# EasyEDA schematic SCH_PCB - project_2022-06-17.json

## Sheets
1 Sheet_1: TITLE: Task 7.3D PWM; REV: 1.0; Date: 2022-06-16; Sheet: 1/1; Drawn By: Frozen; Company: Avinash Maurya
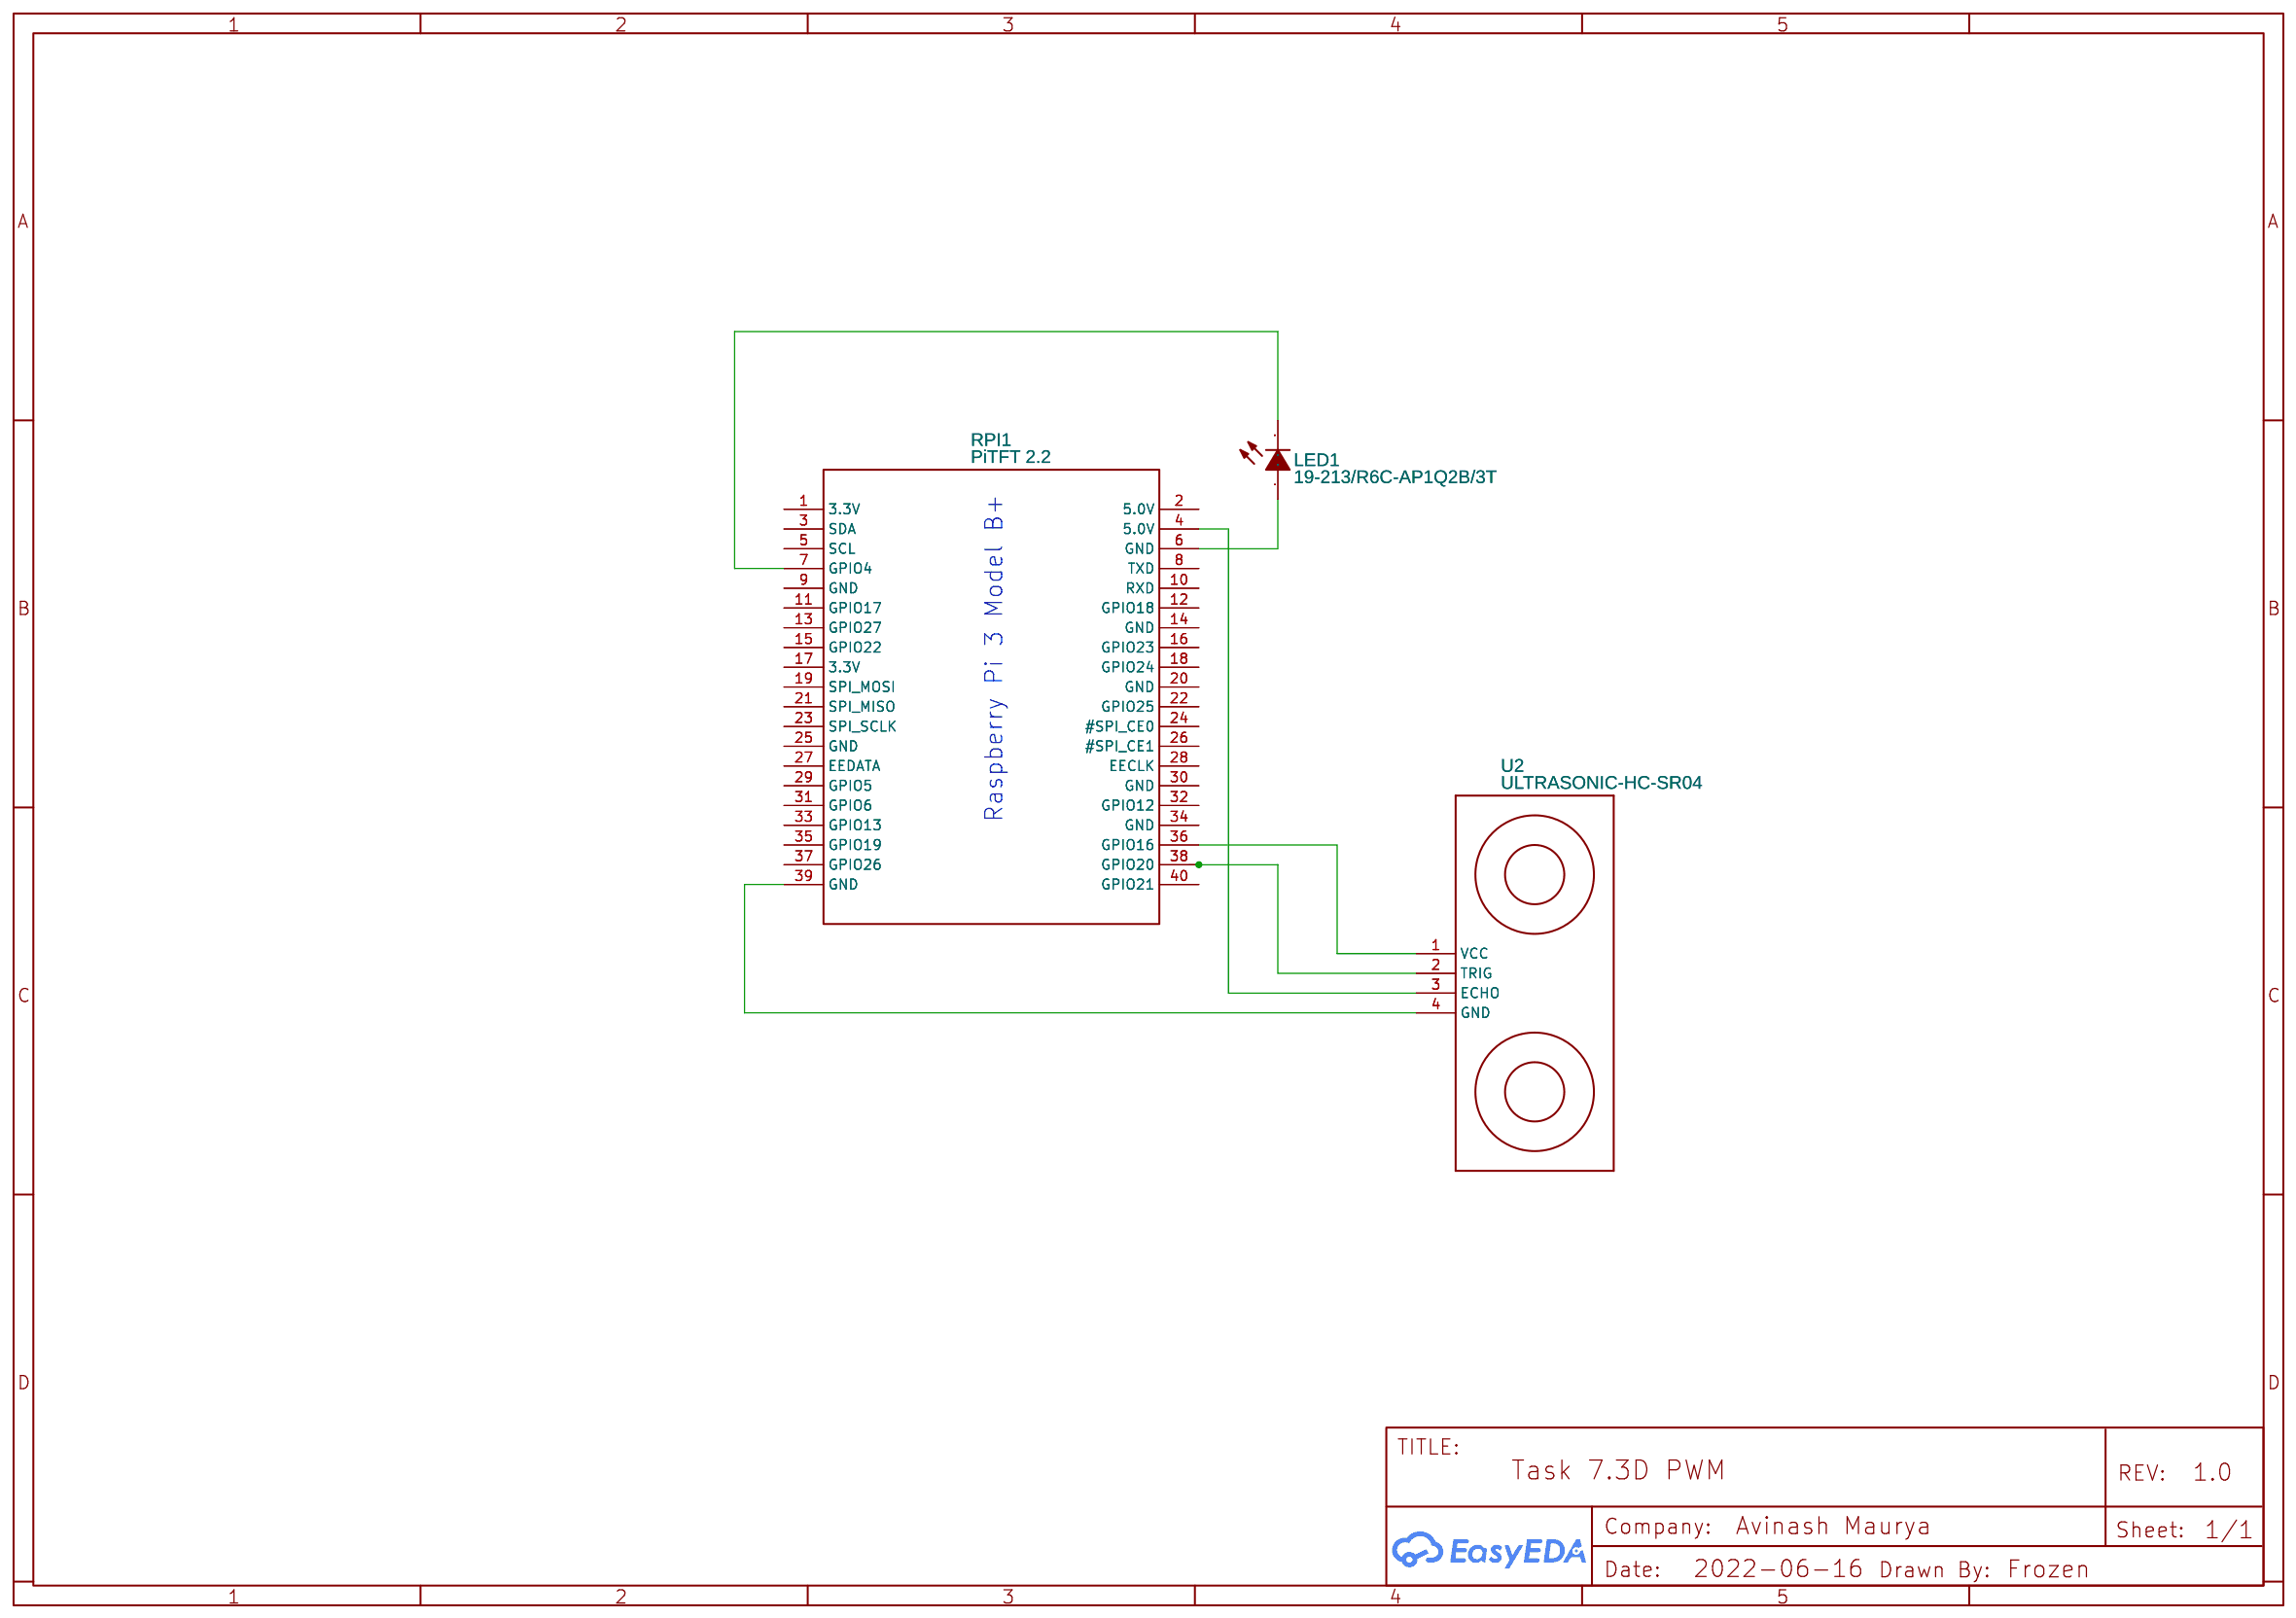
[diagram p0: Sheet_1]
2 Sheet_2: TITLE: Project
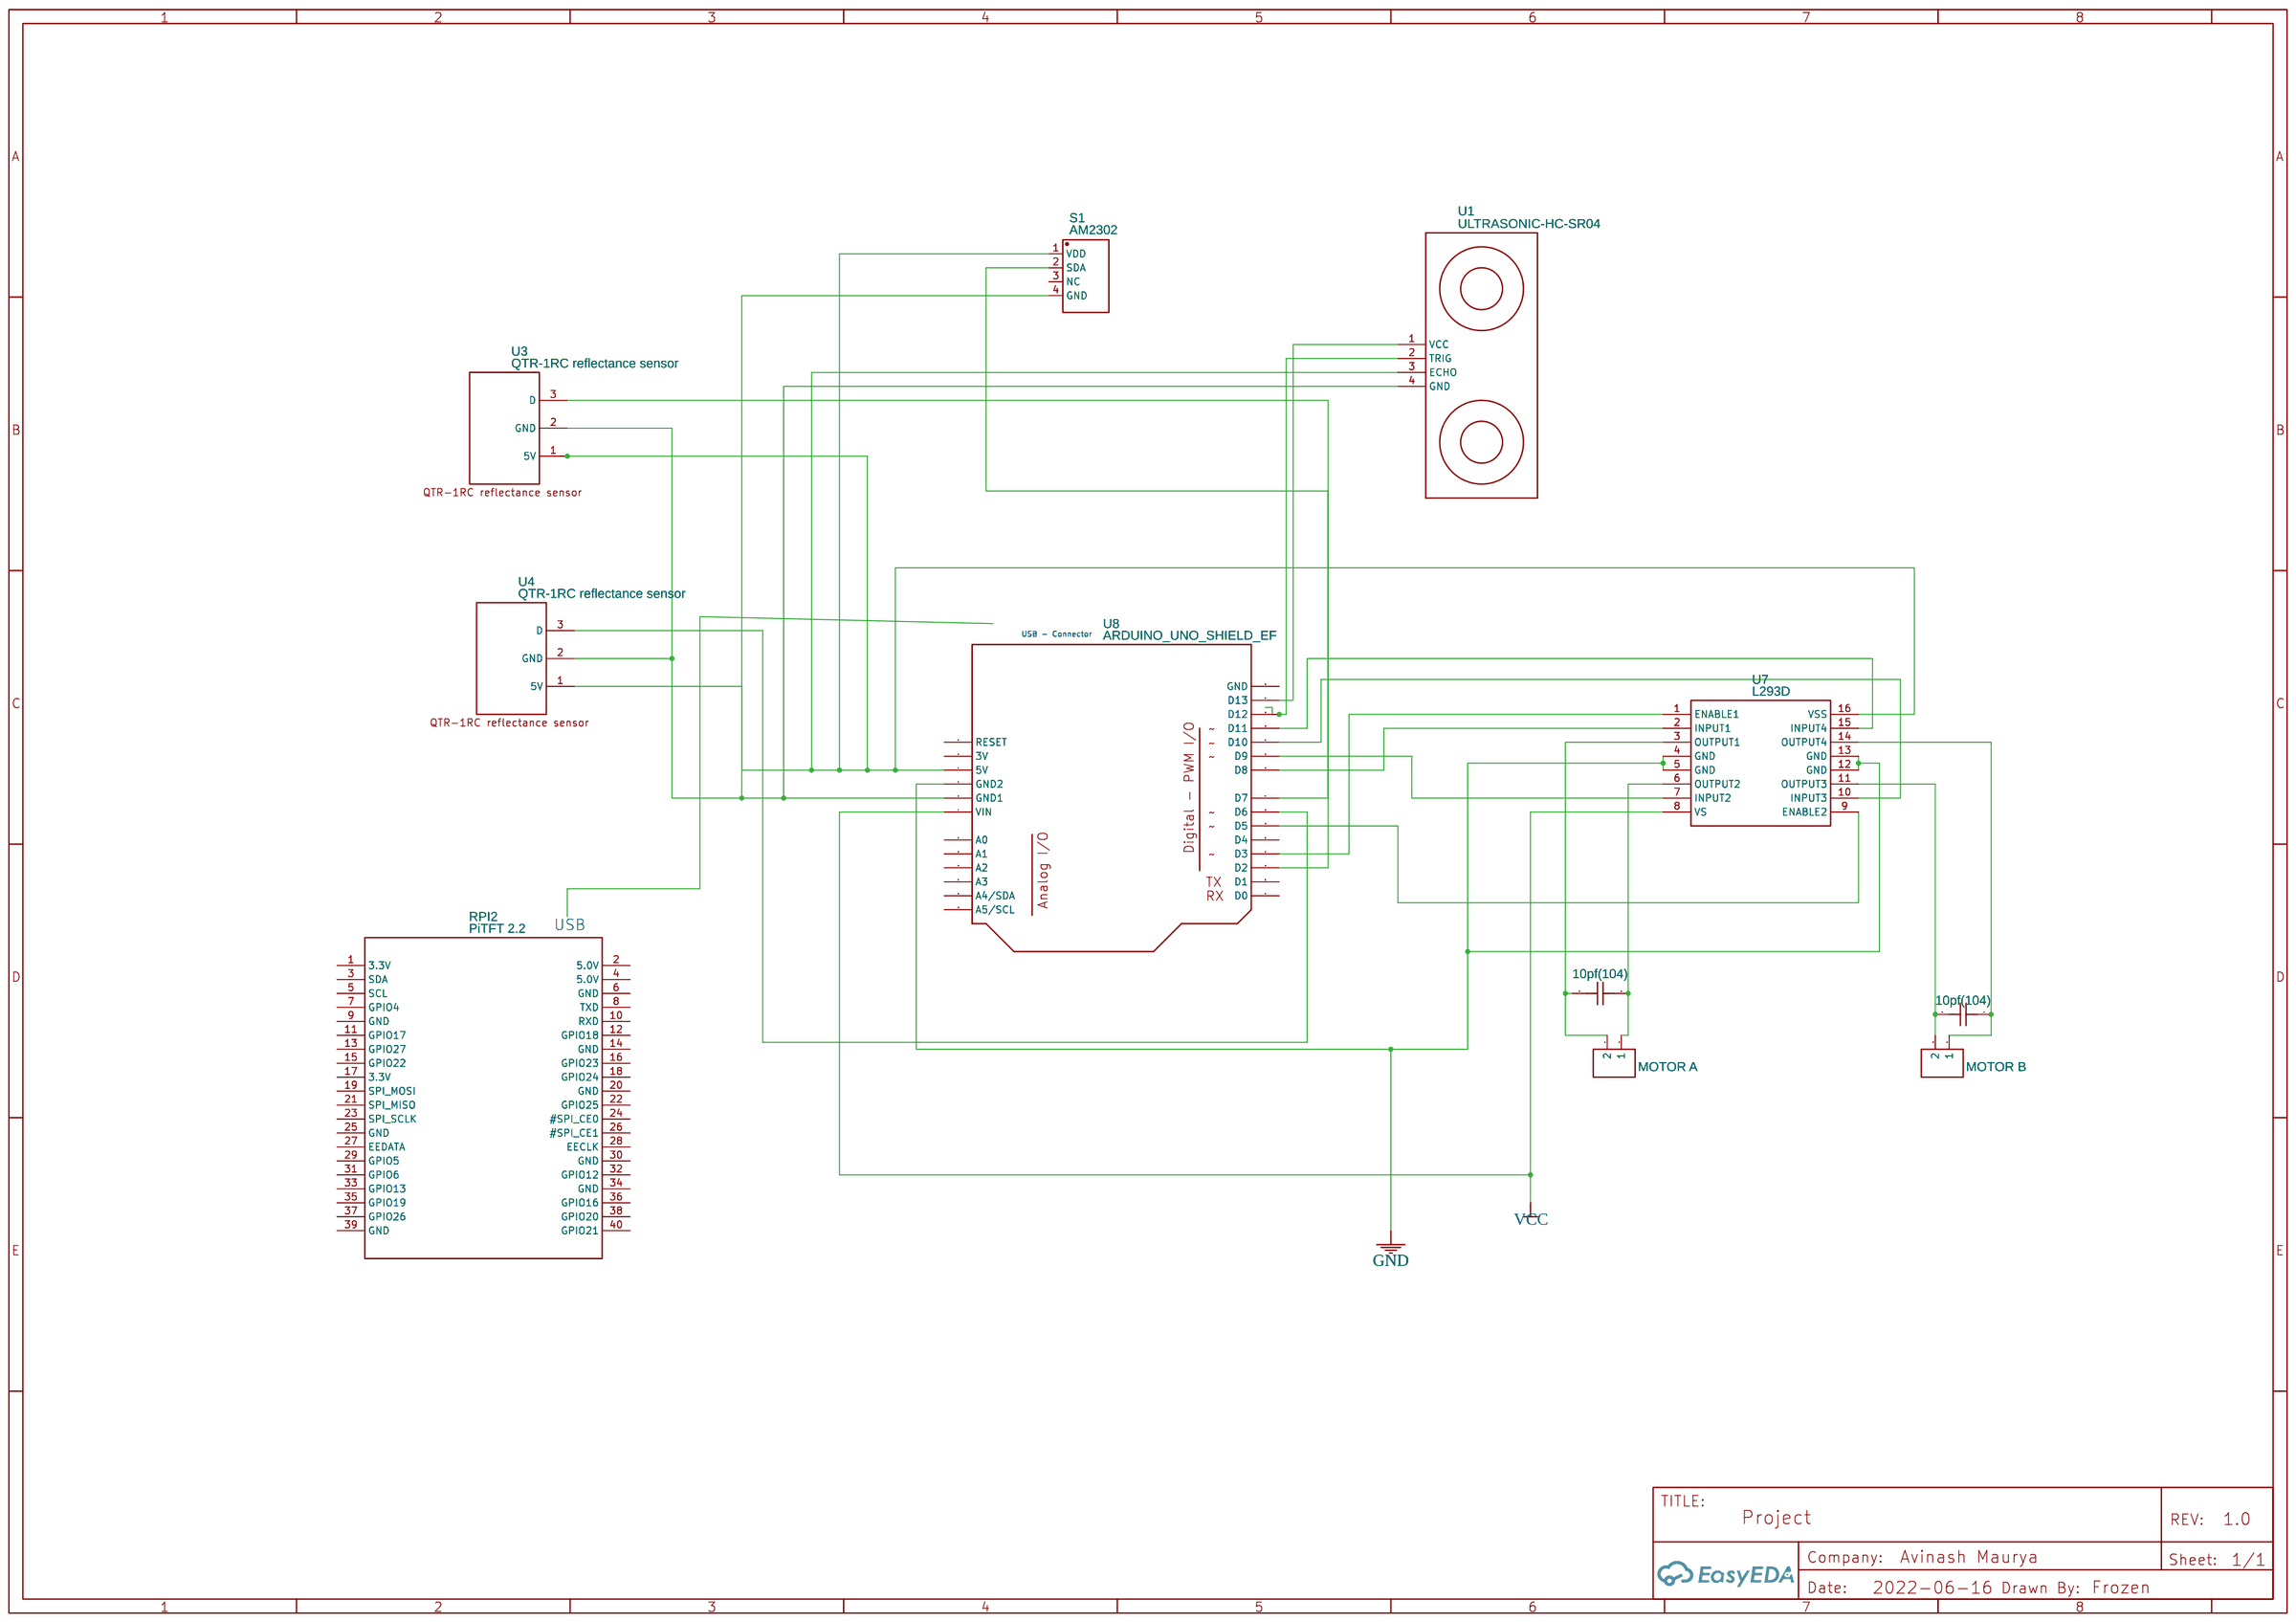
[diagram p1: Sheet_2]

## Parts
sheet Sheet_1
LED1  19-213/R6C-AP1Q2B/3T  [LED0603-R-RD]
RPI1  PiTFT 2.2  [PITFT 2.2]
U2  ULTRASONIC-HC-SR04  [ULTRASONIC-HC-SR04]
sheet Sheet_2
C1  10pf(104)  [RAD-0.1]
C2  10pf(104)  [RAD-0.1]
P2  MOTOR A  [HDR-1X2/2.54]
P3  MOTOR B  [HDR-1X2/2.54]
RPI2  PiTFT 2.2  [PITFT 2.2]
S1  AM2302  [SENSOR-TH_AM2302]
U1  ULTRASONIC-HC-SR04  [ULTRASONIC-HC-SR04]
U3  QTR-1RC reflectance sensor  [QTR-1RC REFLECTANCE SENSOR]
U4  QTR-1RC reflectance sensor  [QTR-1RC REFLECTANCE SENSOR]
U7  L293D  [DIP-16]
U8  ARDUINO_UNO_SHIELD_EF  [ARDUINO_UNO_SHIELD_EF]

## Library data of the parts
LED1 = 19-213/R6C-AP1Q2B/3T: Supplier: LCSC; Supplier Part: C212335; Manufacturer: Everlight Elec; Contributor: LCSC
RPI1 RPI2 = PiTFT 2.2: sourceId: vnhasKEWe
U1 U2 = ULTRASONIC-HC-SR04: Ultrasonic Ranging Module HC-SR04; sourceId: iECXHFpLv
C1 C2 = Cap_RAD-0.1_US
P2 P3 = -: Supplier: LCSC; Manufacturer: BOOMELE; Manufacturer Part: 2.54-1*2PFemale; image: //image.lceda.cn/szlcsc/C49661.jpg; Supplier Part: C49661
S1 = AM2302: Supplier: LCSC; Manufacturer: AOSONG; Supplier Part: C83988; JLCPCB Part Class: Extended Part
U3 U4 = QTR-1RC reflectance sensor: Contributor: winter2015; sourceId: YsmgyP7pj
U7 = -: Contributor: pitreluc; Supplier: LCSC; Manufacturer: STMicroelectronics; image: //image.lceda.cn/szlcsc/C12340.jpg; Supplier Part: C12340
U8 = -: Manufacturer Part: Arduino_UNO_R3_Shield; Contributor: carloscastro

## Nets
GND: U7.4(GND) U7.5(GND) U7.12(GND) U7.13(GND) U8.5(GND2)
VCC: U7.8(VS) U8.7(VIN)
Net-(C1-1): C1.1 P3.1 U7.14(OUTPUT4)
Net-(C1-2): C1.2 P3.2 U7.11(OUTPUT3)
Net-(C2-1): C2.1 P2.2 U7.3(OUTPUT1)
Net-(C2-2): C2.2 P2.1 U7.6(OUTPUT2)
Net-(LED1-1): LED1.1(A) RPI1.6(GND)
Net-(LED1-2): LED1.2(C) RPI1.7(GPIO4)
Net-(RPI1-4): RPI1.4(5.0V) U2.3(ECHO)
Net-(RPI1-36): RPI1.36(GPIO16) U2.1(VCC)
Net-(RPI1-38): RPI1.38(GPIO20) U2.2(TRIG)
Net-(RPI1-39): RPI1.39(GND) U2.4(GND)
Net-(S1-1): S1.1(VDD) U1.3(ECHO) U3.1(5V) U4.1(5V) U7.16(VSS) U8.4(5V)
Net-(S1-2): S1.2(SDA) U8.16(D2)
Net-(S1-4): S1.4(GND) U1.4(GND) U3.2(GND) U4.2(GND) U8.6(GND1)
Net-(U1-1): U1.1(VCC) U8.27(D13)
Net-(U1-2): U1.2(TRIG) U8.26(D12)
Net-(U3-3): U3.3(D) U8.21(D7)
Net-(U4-3): U4.3(D) U8.20(D6)
Net-(U7-1): U7.1(ENABLE1) U8.17(D3)
Net-(U7-2): U7.2(INPUT1) U8.22(D8)
Net-(U7-7): U7.7(INPUT2) U8.23(D9)
Net-(U7-9): U7.9(ENABLE2) U8.19(D5)
Net-(U7-10): U7.10(INPUT3) U8.24(D10)
Net-(U7-15): U7.15(INPUT4) U8.25(D11)

Not connected (* = marked no-connect by the designer): RPI1 1(3.3V) 2(5.0V) 3(SDA) 5(SCL) 8(TXD) 9(GND) 10(RXD) 11(GPIO17) 12(GPIO18) 13(GPIO27) 14(GND) 15(GPIO22) 16(GPIO23) 17(3.3V) 18(GPIO24) 19(SPI_MOSI) 20(GND) 21(SPI_MISO) 22(GPIO25) 23(SPI_SCLK) 24(#SPI_CE0) 25(GND) 26(#SPI_CE1) 27(EEDATA) 28(EECLK) 29(GPIO5) 30(GND) 31(GPIO6) 32(GPIO12) 33(GPIO13) 34(GND) 35(GPIO19) 37(GPIO26) 40(GPIO21); RPI2 1(3.3V) 2(5.0V) 3(SDA) 4(5.0V) 5(SCL) 6(GND) 7(GPIO4) 8(TXD) 9(GND) 10(RXD) 11(GPIO17) 12(GPIO18) 13(GPIO27) 14(GND) 15(GPIO22) 16(GPIO23) 17(3.3V) 18(GPIO24) 19(SPI_MOSI) 20(GND) 21(SPI_MISO) 22(GPIO25) 23(SPI_SCLK) 24(#SPI_CE0) 25(GND) 26(#SPI_CE1) 27(EEDATA) 28(EECLK) 29(GPIO5) 30(GND) 31(GPIO6) 32(GPIO12) 33(GPIO13) 34(GND) 35(GPIO19) 36(GPIO16) 37(GPIO26) 38(GPIO20) 39(GND) 40(GPIO21); S1 3(NC); U8 2(RESET) 3(3V) 8(A0) 9(A1) 10(A2) 11(A3) 12(A4/SDA) 13(A5/SCL) 14(D0) 15(D1) 18(D4) 28(GND)

## Notes on the sheets
sheet 1
- Raspberry Pi 3 Model B+
sheet 2
- USB - Connector
- USB
